# Altium schematic sheet PowerInput.SchDoc
size A; SheetNumber: 5; SheetTotal: 6
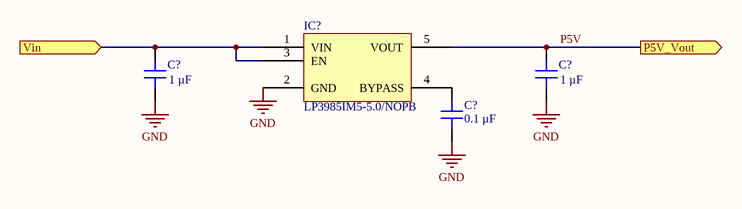
[diagram p0: PowerInput.SchDoc]

## Parts
(Parts that share a designator on the sheet are numbered #1, #2 ... from top to bottom, then left to right.)
C?#1  1 µF  [CAP 0805_2012]
C?#2  1 µF  [CAP 0805_2012]
C?#3  0.1 µF  [CAP 0805_2012]
IC?  LP3985IM5-5.0/NOPB  [TI SOT-23-5 DBV]

## Ports
P5V_Vout (out), Vin (in)

## Nets
GND: C?#1.1 C?#2.1 C?#3.1 IC?.2(GND)
P5V: C?#2.2 IC?.5(VOUT) ; port P5V_Vout
Vin: C?#1.2 IC?.1(VIN) IC?.3(EN) ; port Vin
NetC?#3_2: C?#3.2 IC?.4(BYPASS)

## Library data of the parts
C?#1 C?#2 = C0805C105M3RAC7800: CAP CER 1UF 25V X7R 0805; manufacturer: KEMET; Tolerance: ±20%; Part Number: C0805C105M3RAC7800; Value: 1 µF; Applications: Bypass, Decoupling; Capacitance: 1 µF; componentlink1description: Datasheet; componentlink1url: https://api.kemet.com/component-edge/download/datasheet/C0805C105M3RACTU.pdf; componentlink2description: DigiKey Link; componentlink2url: https://www.digikey.com/en/products/detail/kemet/C0805C105M3RAC7800/2211774; Device Package: 0805 (2012 Metric); lastupdated: 8/21/2023 7:11:38 PM; Lifecycle Status: Active; Minimum Order: 1; Mounting Type: Surface Mount, MLCC; Operating Temperature: -55°C ~ 125°C; Package / Case: 0805 (2012 Metric); packaging: TapeAndReel; partid: 32957; Part Status: Active; price: 0.02; series: SMD Comm X7R; Size / Dimension: 0.079" L x 0.049" W (2.00mm x 1.25mm); Supplier 1: DigiKey; Supplier Part Number 1: 399-C0805C105M3RAC7800CT-ND; Temperature Coefficient: X7R; Thickness (Max): 0.057" (1.45mm); Voltage - Rated: 25V
C?#3 = C0805C104M3RAC7800: CAP CER 0.1UF 25V X7R 0805; manufacturer: KEMET; Tolerance: ±20%; Part Number: C0805C104M3RAC7800; Value: 0.1 µF; Applications: Bypass, Decoupling; Capacitance: 0.1 µF; componentlink1description: Datasheet; componentlink1url: https://api.kemet.com/component-edge/download/datasheet/C0805C104M3RACTU.pdf; componentlink2description: DigiKey Link; componentlink2url: https://www.digikey.com/en/products/detail/kemet/C0805C104M3RAC7800/2211748; Device Package: 0805 (2012 Metric); lastupdated: 8/21/2023 7:11:38 PM; Lifecycle Status: Active; Minimum Order: 1; Mounting Type: Surface Mount, MLCC; Operating Temperature: -55°C ~ 125°C; Package / Case: 0805 (2012 Metric); packaging: TapeAndReel; partid: 32959; Part Status: Active; price: 0.01; series: SMD Comm X7R; Size / Dimension: 0.079" L x 0.049" W (2.00mm x 1.25mm); Supplier 1: DigiKey; Supplier Part Number 1: 399-C0805C104M3RAC7800CT-ND; Temperature Coefficient: X7R; Thickness (Max): 0.035" (0.88mm); Voltage - Rated: 25V
IC? = LP3985IM5-5.0/NOPB: IC REG LINEAR 5V 150MA SOT23-5; Manufacturer: Texas Instruments; Control Features: Enable; Current - Quiescent (Iq): 150 µA; Current - Supply (Max): 250 µA; Number of Regulators: 1; Output Configuration: Positive; Output Type: Fixed; Protection Features: Over Current, Over Temperature, Short Circuit; PSRR: 50dB ~ 40dB (1kHz ~ 10kHz); Voltage Dropout (Max): 0.1V @ 150mA; Voltage - Input (Max): 6V; Part Number: LP3985IM5-5.0/NOPB; ComponentLink1Description: Datasheet; ComponentLink1URL: http://www.ti.com/general/docs/suppproductinfo.tsp?distId=10&gotoUrl=http%3A%2F%2Fwww.ti.com%2Flit%2Fgpn%2Flp3985; ComponentLink2Description: DigiKey Link; ComponentLink2URL: https://www.digikey.com/en/products/detail/texas-instruments/LP3985IM5-5-0-NOPB/483051; Current - Output: 150mA; LastUpdated: 8/22/2023 8:28:20 PM; Lifecycle Status: Active; Minimum Order: 1; Mounting Type: Surface Mount; Operating Temperature: -40°C ~ 125°C; Package / Case: SC-74A, SOT-753; Packaging: TapeAndReel; Part Status: Active; Price: 0.31; Series: -; Supplier 1: DigiKey; Supplier Part Number 1: LP3985IM5-5.0/NOPBCT-ND; Supplier Device Package: SOT-23-5; Voltage - Output (Min/Fixed): 5V